# EAGLE design AutoOff (EAGLE 9.7.0)
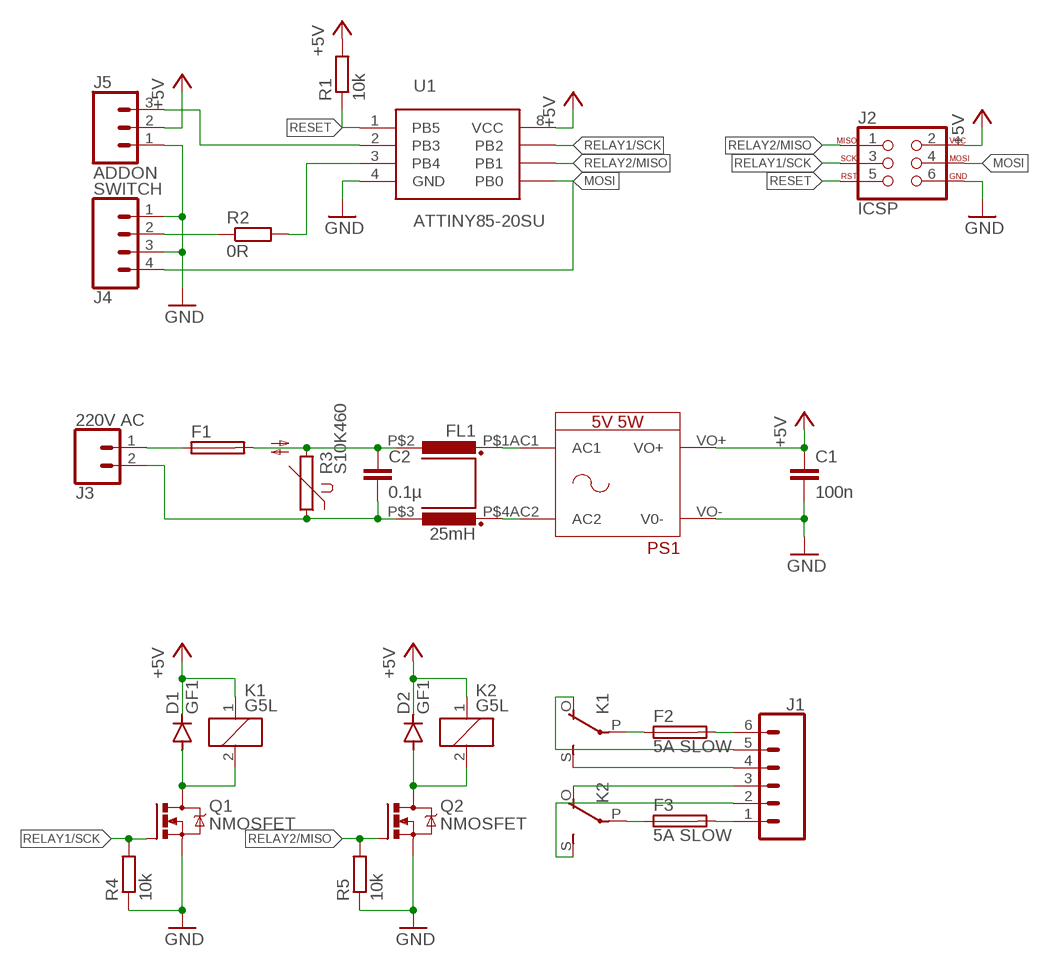
[diagram p0: schematic, sheet 1]

## Parts
C1  100n  C-EUC0603  [C0603]
C2  0.1µ  C-EU102-064X133  [C102-064X133]
D1  GF1  [SMA-DO214AC]
D2  GF1  [SMA-DO214AC]
F1  0.5A SLOW  SH22,5A  [SH22,5A]
F2  5A SLOW  SH22,5A  [SH22,5A]
F3  5A SLOW  SH22,5A  [SH22,5A]
FL1  25mH  UU9.8-YH161014  [UU9.8-YH161014]
J1  CONN_063.5MM-6  [SCREWTERMINAL-3.5MM-6]
J2  ICSP  AVR_SPI_PROG_3X22X3_LOCK  [2X3_LOCK]
J3  220V AC  CONN_023.5MM_LOCK  [SCREWTERMINAL-3.5MM-2_LOCK]
J4  SWITCH  CONN_04SCREW_LOCK  [SCREWTERMINAL-3.5MM-4_LOCK]
J5  ADDON  CONN_03SCREW_LOCK  [SCREWTERMINAL-3.5MM-3_LOCK.007S]
K1  G5L  [G5LE]
K2  G5L  [G5LE]
PS1  5V 5W  HLK-5M05  [HLK-5M]
Q1  NMOSFET  NMOSFET_SOT23  [SOT23]
Q2  NMOSFET  NMOSFET_SOT23  [SOT23]
R1  10k  R-EU_R0603  [R0603]
R2  0R  R-EU_R0603  [R0603]
R3  S10K460  [S10K460]
R4  10k  R-EU_R0603  [R0603]
R5  10k  R-EU_R0603  [R0603]
U1  ATTINY85-20SU  [SOIC-8]

## Nets
+5V [pwr]: C1.1 D1.K(C) D2.K(C) J2.2 J5.2 K1.1 K2.1 PS1.VO+ R1.2 U1.8(VCC)
GND [pwr]: C1.2 J2.6 J4.1 J4.3 J5.1 PS1.VO-(V0-) Q1.2(S) Q2.2(S) R4.1 R5.1 U1.4(GND)
MOSI: J2.4 J4.4 U1.5(PB0)
N$1: J1.3 K2.O(2:O)
N$2: F3.1 K2.P(2:P)
N$3: F3.2 J1.1
N$4: F2.1 K1.P(2:P)
N$5: J1.4 K1.S(2:S)
N$6: F2.2 J1.6
N$7: J1.2 K2.S(2:S)
N$8: J1.5 K1.O(2:O)
N$9: FL1.P$1 PS1.AC1
N$10: D1.A K1.2 Q1.3(D)
N$11: FL1.P$4 PS1.AC2
N$12: D2.A K2.2 Q2.3(D)
N$13: J4.2 R2.1
N$14: R2.2 U1.3(PB4)
N$15: J5.3 U1.2(PB3)
N$16: F1.1 J3.1
N$18: C2.2 FL1.P$3 J3.2 R3.1
N$19: C2.1 F1.2 FL1.P$2 R3.2
RELAY1/SCK: J2.3 Q1.1(G) R4.2 U1.7(PB2)
RELAY2/MISO: J2.1 Q2.1(G) R5.2 U1.6(PB1)
RESET: J2.5 R1.1 U1.1(PB5)

## Library data of the parts
C1 C2 = rcl:C-EU: CAPACITOR, European symbol; SPICEPREFIX: C
D1 D2 = diode:GF1: DIODE
F1-F3 = Parts:SH22,5A: FUSE HOLDER grid 22,5mm, isolated cap OGN0031 8201, Schurter (Buerklin); MPN: 0031.7701.11; OC_FARNELL: unknown; OC_NEWARK: 04F1224
FL1 = Parts:UU9.8-YH161014
J1 = SparkFun-Connectors:CONN_06: Multi connection point. Often used as Generic Header-pin footprint for 0.1 inch spaced/style header connections On any of the 0.1 inch spaced packages, you can populate with these: Break Away Headers - Straight <https://www.sparkfun.com/products/116> (PRT-00116) Break Away Male Headers - Right Angle <https://www.sparkfun.com/products/553> (PRT-00553) Female Headers <https://www.sparkfun.com/products/115> (PRT-00115) Break Away Headers - Machine Pin <https://www.sparkfun.com/products/117> (PRT-00117) Break Away Female Headers - Swiss Machine Pin <https://www.sparkfun.com/products/743> (PRT-00743) Arduino Stackable Header - 6 Pin <https://www.sparkfun.com/products/9280> (PRT-09280) For SCREWTERMINALS and SPRING TERMINALS visit here: Screw Terimnals on SparkFun.com <https://www.sparkfun.com/search/results?term=Screw+Terminals> (5mm/3.5mm/2.54mm spacing) This device is also useful as a general connection point to wire up your design to another part of your project. Our various solder wires solder well into these plated through hole pads. Hook-Up Wire - Assortment (Stranded, 22 AWG) <https://www.sparkfun.com/products/11375> (PRT-11375) Hook-Up Wire - Assortment (Solid Core, 22 AWG) <https://www.sparkfun.com/products/11367> (PRT-11367) View the entire wire category on our website here <https://www.sparkfun.com/categories/141>
J2 = SparkFun-Connectors:AVR_SPI_PROG_3X2: AVR ISP 6 Pin This is the reduced ISP connector for AVR programming. Common on Arduino. This footprint will take up less PCB space and can be used with a 10-pin to 6-pin adapter such as SKU: BOB-08508 **Special note about "TEST_POINT" package. The stop mask is on the top side, so if you want your programming test points to be on the bottom of your board, make sure to place this package on the bottom side of the board. This also ensure that the orientation to program from the bottom side will be correct. SparkFun Products: SparkFun ISP Pogo Adapter <https://www.sparkfun.com/products/11591> - NS Tiny AVR Programmer <https://www.sparkfun.com/products/11801> -PTH
J3 = SparkFun-Connectors:CONN_02: Multi connection point. Often used as Generic Header-pin footprint for 0.1 inch spaced/style header connections On any of the 0.1 inch spaced packages, you can populate with these: Break Away Headers - Straight <https://www.sparkfun.com/products/116> (PRT-00116) Break Away Male Headers - Right Angle <https://www.sparkfun.com/products/553> (PRT-00553) Female Headers <https://www.sparkfun.com/products/115> (PRT-00115) Break Away Headers - Machine Pin <https://www.sparkfun.com/products/117> (PRT-00117) Break Away Female Headers - Swiss Machine Pin <https://www.sparkfun.com/products/743> (PRT-00743) For SCREWTERMINALS and SPRING TERMINALS visit here: Screw Terimnals on SparkFun.com <https://www.sparkfun.com/search/results?term=Screw+Terminals> (5mm/3.5mm/2.54mm spacing) This device is also useful as a general connection point to wire up your design to another part of your project. Our various solder wires solder well into these plated through hole pads. Hook-Up Wire - Assortment (Stranded, 22 AWG) <https://www.sparkfun.com/products/11375> (PRT-11375) Hook-Up Wire - Assortment (Solid Core, 22 AWG) <https://www.sparkfun.com/products/11367> (PRT-11367) View the entire wire category on our website here <https://www.sparkfun.com/categories/141> Special notes: Molex polarized connector foot print use with: PRT-08233 with associated crimp pins and housings. 2.54_SCREWTERM for use with PRT-10571. 3.5mm Screw Terminal footprints for PRT-08084 5mm Screw Terminal footprints for use with PRT-08432; PROD_ID: CONN-08399
J4 = SparkFun-Connectors:CONN_04: Multi connection point. Often used as Generic Header-pin footprint for 0.1 inch spaced/style header connections On any of the 0.1 inch spaced packages, you can populate with these: Break Away Headers - Straight <https://www.sparkfun.com/products/116> (PRT-00116) Break Away Male Headers - Right Angle <https://www.sparkfun.com/products/553> (PRT-00553) Female Headers <https://www.sparkfun.com/products/115> (PRT-00115) Break Away Headers - Machine Pin <https://www.sparkfun.com/products/117> (PRT-00117) Break Away Female Headers - Swiss Machine Pin <https://www.sparkfun.com/products/743> (PRT-00743) For SCREWTERMINALS and SPRING TERMINALS visit here: Screw Terimnals on SparkFun.com <https://www.sparkfun.com/search/results?term=Screw+Terminals> (5mm/3.5mm/2.54mm spacing) This device is also useful as a general connection point to wire up your design to another part of your project. Our various solder wires solder well into these plated through hole pads. Hook-Up Wire - Assortment (Stranded, 22 AWG) <https://www.sparkfun.com/products/11375> (PRT-11375) Hook-Up Wire - Assortment (Solid Core, 22 AWG) <https://www.sparkfun.com/products/11367> (PRT-11367) View the entire wire category on our website here <https://www.sparkfun.com/categories/141> Special notes: Molex polarized connector foot print use with SKU : PRT-08231 with associated crimp pins and housings. 1MM SMD Version SKU: PRT-10208
J5 = SparkFun-Connectors:CONN_03: Multi connection point. Often used as Generic Header-pin footprint for 0.1 inch spaced/style header connections On any of the 0.1 inch spaced packages, you can populate with these: Break Away Headers - Straight <https://www.sparkfun.com/products/116> (PRT-00116) Break Away Male Headers - Right Angle <https://www.sparkfun.com/products/553> (PRT-00553) Female Headers <https://www.sparkfun.com/products/115> (PRT-00115) Break Away Headers - Machine Pin <https://www.sparkfun.com/products/117> (PRT-00117) Break Away Female Headers - Swiss Machine Pin <https://www.sparkfun.com/products/743> (PRT-00743) Stackable Header - 3 Pin (Female, 0.1") <https://www.sparkfun.com/products/13875> (PRT-13875) For SCREWTERMINALS and SPRING TERMINALS visit here: Screw Terimnals on SparkFun.com <https://www.sparkfun.com/search/results?term=Screw+Terminals> (5mm/3.5mm/2.54mm spacing) This device is also useful as a general connection point to wire up your design to another part of your project. Our various solder wires solder well into these plated through hole pads. Hook-Up Wire - Assortment (Stranded, 22 AWG) <https://www.sparkfun.com/products/11375> (PRT-11375) Hook-Up Wire - Assortment (Solid Core, 22 AWG) <https://www.sparkfun.com/products/11367> (PRT-11367) View the entire wire category on our website here <https://www.sparkfun.com/categories/141> Special notes: Molex polarized connector foot print use with SKU : PRT-08232 with associated crimp pins and housings.; PROD_ID: CONN-08288; SF_ID: PRT-08235
K1 K2 = relay:G5L: RELAY 1 x switch, 10 A/120 V AC, 8 A/30 V ADC, Omron; OC_FARNELL: unknown; OC_NEWARK: unknown
PS1 = Parts:HLK-5M05
Q1 Q2 = Transistor:NMOSFET: N-Channel MOSFET - Generic; CATEGORY: Transistor; SUB-CATEGORY: MOSFET; TYPE: N-Channel
R1 R2 R4 R5 = rcl:R-EU_: RESISTOR, European symbol; SPICEPREFIX: R
R3 = varistor:S10K460: VARISTOR
U1 = Microcontroller:ATTINY85-20SU: IC MCU 8BIT 8KB FLASH 8SOIC Manufacturer's datasheet <http://ww1.microchip.com/downloads/en/DeviceDoc/Atmel-2586-AVR-8-bit-Microcontroller-ATtiny25-ATtiny45-ATtiny85_Datasheet-Summary.pdf>; CREATED_BY: PCBLayout.com; DIGI_KEY_PART_NUMBER: ATTINY85-20SU-ND; MANUFACTURER: Microchip Technology; MPN: ATTINY85-20SU; PACKAGE: 8-SOIC

## Board
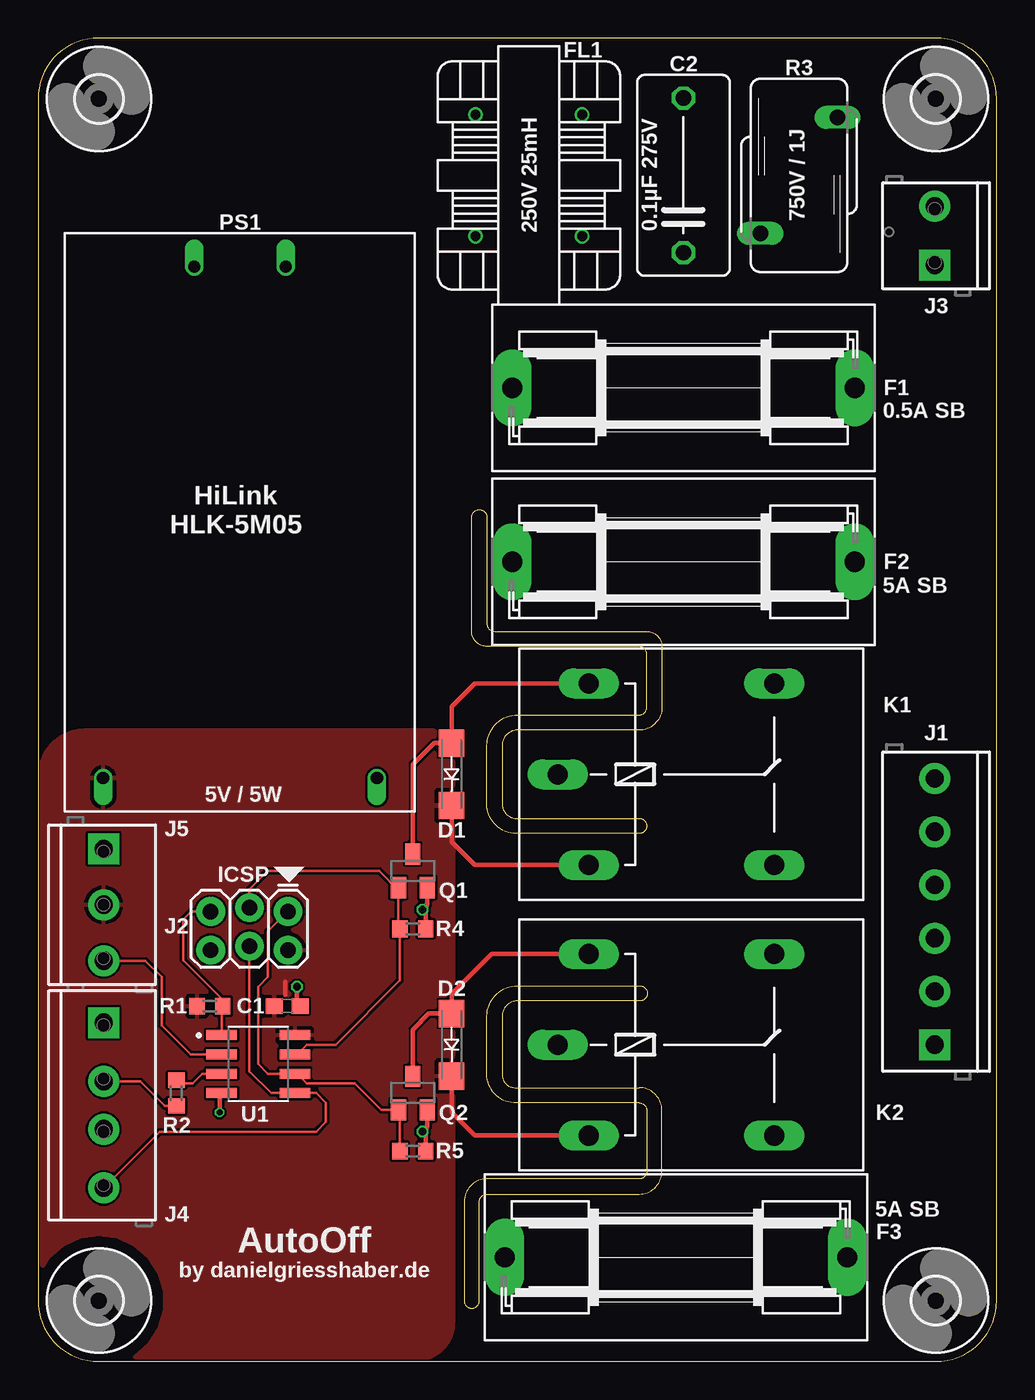
[diagram p1: board, top side]
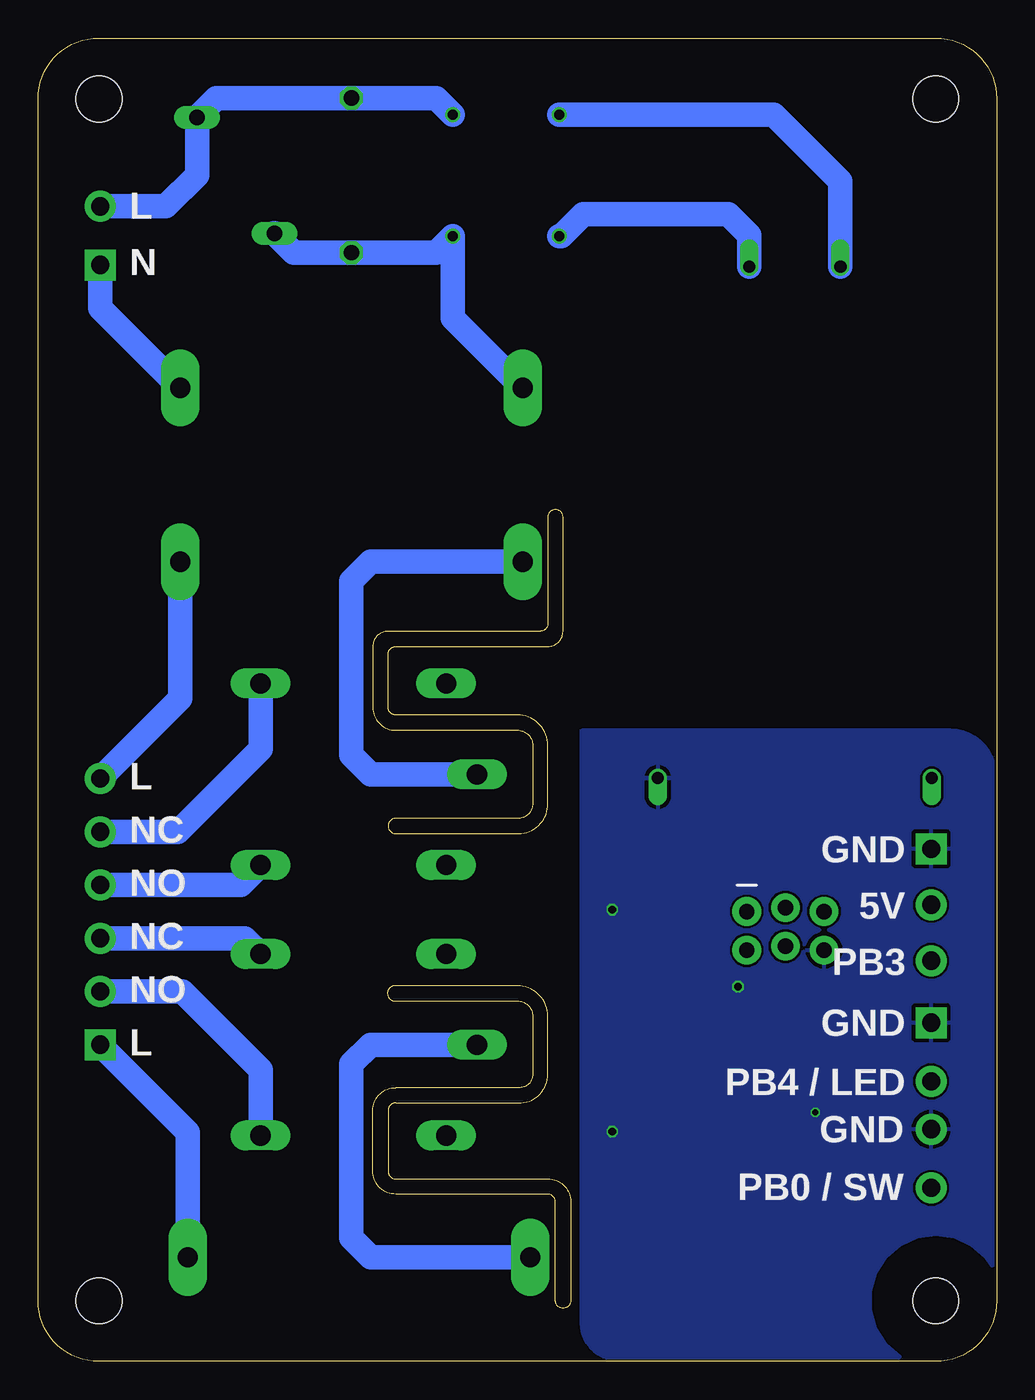
[diagram p2: board, bottom side, seen from below]

Size 63 x 87 mm. Coordinates in mm from the lower left corner, seen from the top.
Outline: 0,83 0,4 arc90 4,0 59,0 arc90 63,4 63,83 arc90 59,87 4,87 arc90 0,83
Outline: 39.5,41.5 31.5,41.5 arc90 30.5,40.5 30.5,36.6 arc90 31.5,35.7 39.5,35.7 arc-90 40,35.2 arc-90 39.5,34.7 31.6,34.7 arc-90 29.5,36.5 29.5,40.5 arc-90 31.5,42.5 39.5,42.5 arc90 40,43 40,46.5 arc90 39.5,47 29.5,47 arc-90 28.5,48 28.5,55.5 arc-90 29,56 arc-90 29.5,55.5 29.5,48.5 arc90 30,48 40,48 arc-90 41,47 41,43 arc-90 39.5,41.5
Outline: 39.54,23.7 31.5,23.7 arc90 30.5,22.7 30.5,18.8 arc90 31.4,18 39.5,18 arc-90 41,16.5 41,12.5 arc-90 39.5,11 29.5,11 arc90 29,10.5 29,4 arc-90 28.5,3.5 arc-90 28,4 28,10.5 arc-90 29.5,12 39.5,12 arc90 40,12.5 40,16.5 arc90 39.5,17 31.6,17 arc-90 29.5,18.7 29.5,22.7 arc-90 31.5,24.7 39.54,24.7 arc-90 40.04,24.2 arc-90 39.54,23.7
Copper layers (1*16): Top 0.035mm / dielectric 0.2mm / Bottom 0.035mm
Design rules "jlcpcb-2layer": minimum track width 3.5mil, minimum drill 0.2mm, track to track 3.5mil, track to pad 5mil, pad to pad 5mil, via to via 5mil, smd to smd 0mil, copper to edge 0.1mm, drill to drill 5mil, minimum pad ring 4mil, minimum via ring 4mil, stop-mask expansion 3mil, vias tented up to drill 100mil, thermal gap 10mil

### Footprints (pad centres in the part's own frame; a part is rotated, then mirrored left to right if it is on the bottom)
C0603 = smd 1.1 x 1: 1 -0.85,0; 2 0.85,0
C102-064X133 = drill 1.016 octagon: 1 -5.08,0; 2 5.08,0
SMA-DO214AC = smd 1.8 x 1.7: A -2.05,0; K 2.05,0
SH22,5A = drill 1.321 pad 2.54 long: 1 -11.252,0; 2 11.252,0
UU9.8-YH161014 = drill 0.65: P$1 -3.5,-4; P$2 3.5,-4; P$3 3.5,4; P$4 -3.5,4
SCREWTERMINAL-3.5MM-6 = drill 1.2 pad 2.032 square: 1 0,0 | drill 1.2 pad 2.032: 2 3.5,0; 3 7,0; 4 10.5,0; 5 14,0; 6 17.5,0
2X3_LOCK = drill 1.016 pad 1.88: 1 0,0.127; 2 0,2.667; 3 2.54,-0.127; 4 2.54,2.413; 5 5.08,0.127; 6 5.08,2.667
SCREWTERMINAL-3.5MM-2_LOCK = drill 1.2 pad 2.032 square: 1 -0.178,0 | drill 1.2 pad 2.032: 2 3.678,0
SCREWTERMINAL-3.5MM-4_LOCK = drill 1.2 pad 2.032 square: 1 -0.178,0 | drill 1.2 pad 2.032: 2 3.678,0; 3 6.822,0; 4 10.678,0
SCREWTERMINAL-3.5MM-3_LOCK.007S = drill 1.2 pad 2.032 square: 1 -0.178,0 | drill 1.2 pad 2.032: 2 3.5,0; 3 7.178,0
G5LE = drill 1.321 long: 1 -7.493,-5.969; 2 -7.493,5.969; O 4.699,5.969; P -9.525,0; S 4.699,-5.969
HLK-5M = drill 0.8 offset: AC1 2.2,14.5; AC2 2.2,8.5; VO+ 35.8,2.5; VO- 35.8,20.5
SOT23 = smd 1 x 1.4: 1 -0.95,-1.1; 2 0.95,-1.1; 3 0,1.1
R0603 = smd 1 x 1.1: 1 -0.85,0; 2 0.85,0
S10K460 = drill 1.016 long: 1 -2.54,-3.81; 2 2.54,3.81
SOIC-8 = smd 2 x 0.66: 1 -2.405,1.905; 2 -2.405,0.635; 3 -2.405,-0.635; 4 -2.405,-1.905; 5 2.405,-1.905; 6 2.405,-0.635; 7 2.405,0.635; 8 2.405,1.905
3,0 = hole 3: 0,0

### Placement (x,y rotation side)
C1  16.38,23.36 0 top
C2  42.41,77.97 90 top
D1  27.17,38.6 270 top
D2  27.17,20.82 270 top
F1  42.41,64 180 top
F2  42.41,52.57 0 top
F3  41.91,6.85 0 top
FL1  32.25,77.97 0 top
J1  58.92,20.82 90 top
J2  16.43,29.71 180 top
J3  58.92,72.26 90 top
J4  4.31,22.09 270 top
J5  4.31,33.52 270 top
K1  43.68,38.6 0 top
K2  43.68,20.82 0 top
PS1  1.77,74.16 270 top
Q1  24.63,32.25 0 top
Q2  24.63,17.64 0 top
R1  11.3,23.36 180 top
R2  9.09,17.64 90 top
R3  50,77.97 180 top
R4  24.63,28.44 180 top
R5  24.63,13.84 180 top
U1  14.47,19.55 0 top
U$1  [3,0]  4,83 0 top
U$2  [3,0]  4,4 0 top
U$3  [3,0]  59,4 0 top
U$4  [3,0]  59,83 0 top

### Tracks (layer width: path | path; a pad name or v marks a point on that pad's centre or on a via)
+5V
  Top 0.305: K1.1 28.69,32.63 27.17,34.15 D1.K | K2.1 28.69,14.85 27.17,16.38 D2.K | 16.25,24.09 16.25,24.94
  pour Top (isolate 0.152): 0,0 0,38.56 arc-90 3.04,41.6 27.4,41.6 27.4,2.54 arc-90 24.86,0
GND  (via drill 0.4, 0.5)
  Top 0.305: v11.93,16.38 11.93,17.51 U1.4 | Q2.2 25.58,15.42 v25.27,15.11 25.48,14.89 R5.1 | Q1.2 25.58,30.03 v25.27,29.71 25.48,29.5 R4.1 | C1.2 17.01,23.57 v17.01,24.63
  pour Bottom (isolate 0.152): 0,0 0,38.56 arc-90 3.04,41.6 27.4,41.6 27.4,2.54 arc-90 24.86,0
MOSI
  Top 0.152: J2.4 13.89,19.07 15.31,17.64 U1.5 18.28,17.64 18.91,17.01 18.91,15.74 18.28,15.11 8,15.11 J4.4
N$1
  Bottom 1.626: J1.3 49.41,27.82 K2.O
N$2
  Bottom 1.626: F3.1 41.14,6.85 42.41,8.12 42.41,19.55 41.14,20.82 K2.P
N$3
  Bottom 1.626: J1.1 53.17,15.07 F3.2
N$4
  Bottom 1.626: F2.1 41.14,52.57 42.41,51.3 42.41,39.87 41.14,38.6 K1.P
N$5
  Bottom 1.626: J1.4 49.69,31.32 K1.S
N$6
  Bottom 1.626: F2.2 53.66,43.58 J1.6
N$7
  Bottom 1.626: K2.S 48.38,19.17 53.53,24.32 J1.2
N$8
  Bottom 1.626: J1.5 53.81,34.82 48.38,40.25 K1.O
N$9
  Bottom 1.626: FL1.P$1 28.63,73.97 27.17,75.43 17.64,75.43 16.27,74.06 PS1.AC1
N$10
  Top 0.305: K1.2 28.69,44.57 27.17,43.04 D1.A 26.05,40.65 24.63,39.23 Q1.3
N$11
  Bottom 1.626: FL1.P$4 14.66,81.97 10.27,77.58 PS1.AC2
N$12
  Top 0.305: K2.2 29.8,26.79 27.17,24.16 D2.A 25.69,22.87 24.63,21.81 Q2.3
N$13
  Top 0.152: R2.1 8.34,16.8 6.72,18.41 J4.2
N$14
  Top 0.152: U1.3 10.8,18.91 10.16,18.28 9.31,18.28 R2.2
N$15
  Top 0.152: U1.2 10.03,20.19 8.12,22.09 8.12,25.27 7.04,26.34 J5.3
N$16
  Bottom 1.626: J3.1 58.92,69.26 F1.1
N$18
  Bottom 1.626: J3.2 54.61,75.93 52.54,78 R3.1 51.27,83.05 C2.2 36.83,83.05 FL1.P$3
N$19
  Bottom 1.626: R3.2 46.2,72.89 C2.1 36.83,72.89 FL1.P$2 35.75,68.59 F1.2
RELAY1/SCK
  Top 0.152: Q1.1 23.68,30.98 | U1.7 17.01,20.19 17.64,20.82 19.55,20.82 23.78,25.05 R4.2 23.68,28.54 23.68,30.98 | J2.3 13.89,31.03 15.11,32.25 22.41,32.25 23.68,30.98
RELAY2/MISO
  Top 0.152: R5.2 23.78,16.45 Q2.1 22.55,16.55 20.82,18.28 17.64,18.28 17.01,18.91 U1.6 15.11,18.91 14.47,19.55 14.47,24.63 15.11,25.27 15.11,28.26 J2.1
RESET
  Top 0.152: J2.5 10.08,29.58 9.54,29.05 9.54,26.38 12.15,23.78 R1.1 12.07,23.28 U1.1

### Text on the board
tNames: FL1 | 250V 25mH | 0.1µF 275V | 750V / 1J | 0.5A SB | HiLink / HLK-5M05 | 5A SB | 5V / 5W | ICSP | 5A SB | AutoOff | by danielgriesshaber.de
bNames: L | N | L | NC | GND | NO | 5V | NC | PB3 | NO | GND | L | PB4 / LED | GND | PB0 / SW